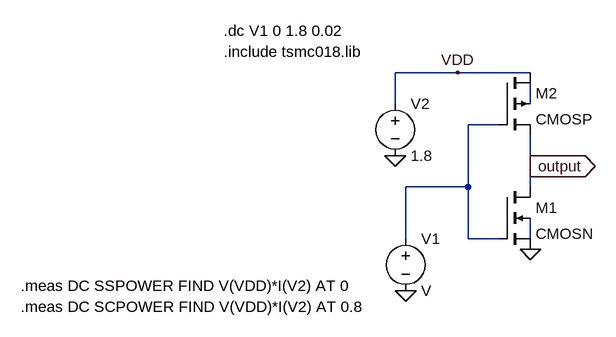
[diagram p0: schematic cmos_dc_power_analysis.asc]
cmos_dc_power_analysis.asc, the LTspice schematic file:
Version 4
SHEET 1 880 680
WIRE 192 0 96 0
WIRE 304 0 192 0
WIRE 96 48 96 0
WIRE 304 48 304 16
WIRE 256 80 208 80
WIRE 304 144 304 96
WIRE 208 176 208 80
WIRE 208 176 112 176
WIRE 304 176 304 144
WIRE 112 256 112 176
WIRE 208 256 208 176
WIRE 256 256 208 256
WIRE 304 256 304 224
FLAG 304 272 0
FLAG 112 336 0
FLAG 96 128 0
FLAG 304 144 output
IOPIN 304 144 Out
FLAG 192 0 VDD
SYMBOL voltage 112 240 R0
SYMATTR InstName V1
SYMBOL voltage 96 32 R0
WINDOW 123 0 0 Left 0
WINDOW 39 0 0 Left 0
SYMATTR InstName V2
SYMATTR Value 1.8
SYMBOL cmosn 256 176 R0
SYMATTR InstName M1
SYMATTR Value2 l=180n w=400n
SYMBOL cmosp 256 0 R0
SYMATTR InstName M2
SYMATTR Value2 l=180n w=800n
TEXT -168 -64 Left 2 !.dc V1 0 1.8 0.02
TEXT -168 -32 Left 2 !.include tsmc018.lib
TEXT -480 360 Left 2 !.meas DC SCPOWER FIND V(VDD)*I(V2) AT 0.8
TEXT -480 328 Left 2 !.meas DC SSPOWER FIND V(VDD)*I(V2) AT 0

The netlist it stands for:
* cmos_dc_power_analysis.asc
V1 N002 0 V
V2 VDD 0 1.8
M1 output N002 0 N003 CMOSN l=180n w=400n
M2 VDD N002 output N001 CMOSP l=180n w=800n
.model NMOS NMOS
.model PMOS PMOS
.lib standard.mos
.dc V1 0 1.8 0.02
.include tsmc018.lib
.meas DC SCPOWER FIND V(VDD)*I(V2) AT 0.8
.meas DC SSPOWER FIND V(VDD)*I(V2) AT 0
.backanno
.end